# Altium schematic sheet TestPCB2.SchDoc
size A4
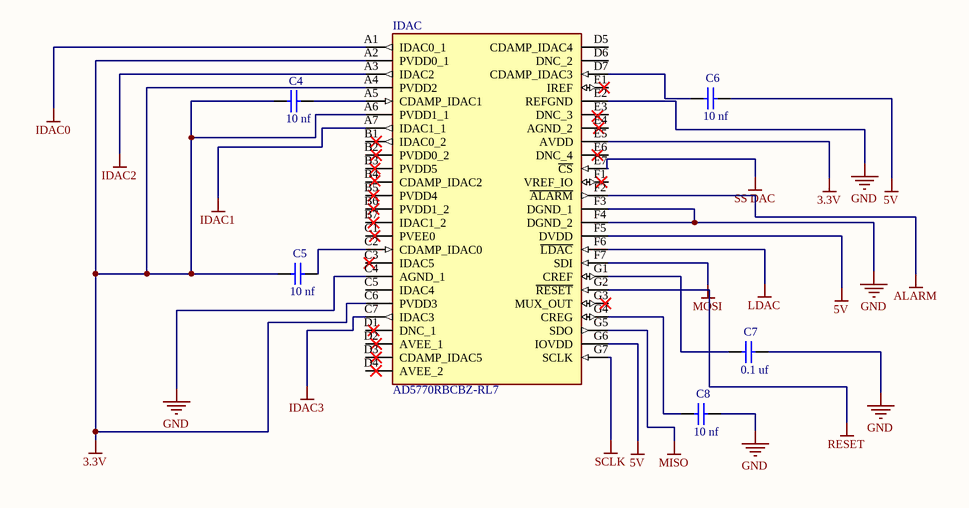
[diagram p0: TestPCB2.SchDoc]

## Parts
C4  10 nf  [CAPC2013X94X50ML20T25]
C5  10 nf  [CAPC2013X94X50ML20T25]
C6  10 nf  [CAPC2013X94X50ML20T25]
C7  0.1 uf  [CAPC2013X94X50ML20T25]
C8  10 nf  [CAPC2013X94X50ML20T25]
IDAC  AD5770RBCBZ-RL7  [BGA49C50P7X7_404X404X66]

## Nets
3.3V: C4.1 C5.1 IDAC.A2(PVDD0_1) IDAC.A4(PVDD2) IDAC.A6(PVDD1_1) IDAC.C6(PVDD3) IDAC.E5(AVDD)
5V: C6.2 IDAC.F5(DVDD) IDAC.G6(IOVDD)
ALARM: IDAC.F2(~{ALARM})
GND: C7.2 C8.2 IDAC.C4(AGND_1) IDAC.E2(REFGND) IDAC.F3(DGND_1) IDAC.F4(DGND_2)
IDAC0: IDAC.A1(IDAC0_1)
IDAC1: IDAC.A7(IDAC1_1)
IDAC2: IDAC.A3(IDAC2)
IDAC3: IDAC.C7(IDAC3)
LDAC: IDAC.F6(~{LDAC})
MISO: IDAC.G5(SDO)
MOSI: IDAC.F7(SDI)
RESET: IDAC.G2(~{RESET})
SCLK: IDAC.G7(SCLK)
SS DAC: IDAC.E7(~{CS})
NetC4_2: C4.2 IDAC.A5(CDAMP_IDAC1)
NetC5_2: C5.2 IDAC.C2(CDAMP_IDAC0)
NetC6_1: C6.1 IDAC.D7(CDAMP_IDAC3)
NetC7_1: C7.1 IDAC.G1(CREF)
NetC8_1: C8.1 IDAC.G4(CREG)

Not connected (* = marked no-connect by the designer): IDAC B1(IDAC0_2) B2(PVDD0_2) B3(PVDD5) B4(CDAMP_IDAC2) B5(PVDD4) B6(PVDD1_2) B7(IDAC1_2) C1(PVEE0) C3(IDAC5) C5(IDAC4) D1(DNC_1) D2(AVEE_1) D3(CDAMP_IDAC5) D4(AVEE_2) D5(CDAMP_IDAC4) D6(DNC_2) E1(IREF) E3(DNC_3) E4(AGND_2) E6(DNC_4) F1(VREF_IO) G3(MUX_OUT)

## Library data of the parts
C4-C8 = CMP-2007-04171-1: Manufacturer: AVX Interconnect / Elco; Part Number: 08051C104JAT2A
IDAC = AD5770RBCBZ-RL7: Integrated Circuit; Manufacturer_Name: Analog Devices; Datasheet Link: https://componentsearchengine.com/Datasheets/1/AD5770RBCBZ-RL7.pdf; Height: 0.66mm; Manufacturer_Part_Number: AD5770RBCBZ-RL7; Mouser Part Number: 584-AD5770RBCBZ-RL7; Mouser Price/Stock: https://www.mouser.com/Search/Refine.aspx?Keyword=584-AD5770RBCBZ-RL7